# EAGLE design SAM_D21_DevBoard (EAGLE 8.1.0)
COMPANY: Tomasz Pasierbski; DRAWN: Pasierbski; REV: A
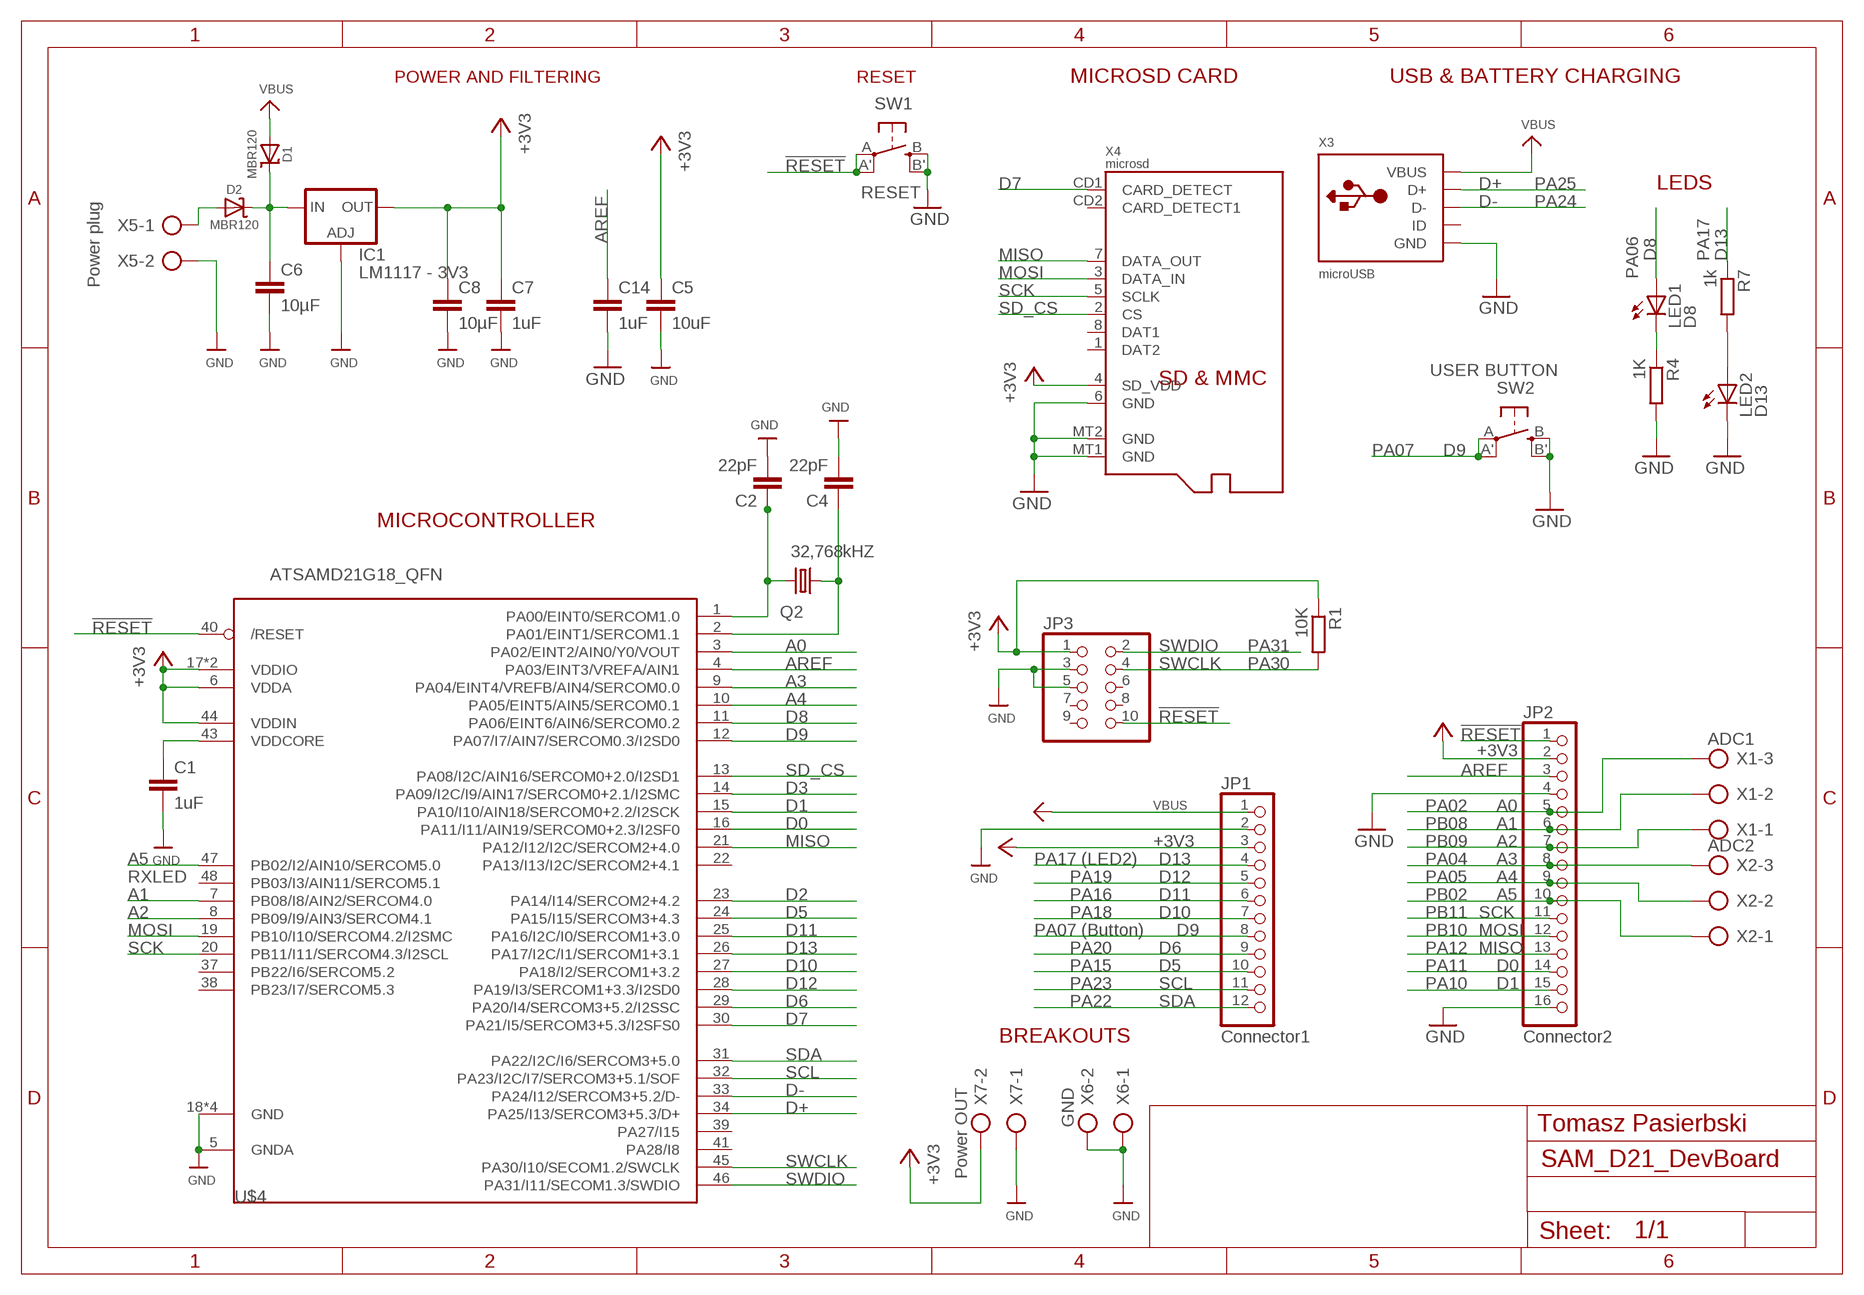
[diagram p0: schematic, sheet 1]

## Parts
C1  1uF  C-EUC1206  [C1206]
C2  22pF  C-EUC1206  [C1206]
C4  22pF  C-EUC1206  [C1206]
C5  10uF  C-EUC1206  [C1206]
C6  10µF  C-EUC1206  [C1206]
C7  1uF  C-EUC1206  [C1206]
C8  10µF  C-EUC1206  [C1206]
C14  1uF  C-EUC1206  [C1206]
D1  MBR120  DIODE-SCHOTTKYSOD-123  [SOD-123]
D2  MBR120  DIODE-SCHOTTKYSOD-123  [SOD-123]
IC1  LM1117 - 3V3  LD117AS33TR  [SOT223]
JP1  Connector1  PINHD-1X12  [1X12]
JP2  Connector2  PINHD-1X16  [1X16]
JP3  PINHD-2X5  [2X05]
LED1  D8  LEDSMT1206  [1206]
LED2  D13  LEDSMT1206  [1206]
Q2  32,768kHZ  CRYSTALHC49UP  [HC49UP]
R1  10K  R-EU_M1206  [M1206]
R4  1K  R-EU_M1206  [M1206]
R7  1k  R-EU_M1206  [M1206]
SW1  RESET  SPST_TACT-EVQQ2  [EVQ-Q2]
SW2  USER BUTTON  SPST_TACT-EVQQ2  [EVQ-Q2]
U$4  ATSAMD21G18_QFN  ATSAMD21J_QFN  [TQFN48_7MM]
X1  ADC1  AK300/3  [AK300/3]
X2  ADC2  AK300/3  [AK300/3]
X3  microUSB  USB_MICRO_20329_V2  [4UCONN_20329_V2]
X4  microsd  MICROSD  [MICROSD]
X5  Power plug  AK300/2  [AK300/2]
X6  GND  AK300/2  [AK300/2]
X7  Power OUT  AK300/2  [AK300/2]

## Nets
!RESET: JP2.1 JP3.10 SW1.A'(P1) SW1.A(P) U$4.40(/RESET)
+3V3: C5.1 C7.1 C8.1 IC1.4(OUT) JP1.3 JP2.2 JP3.1 R1.1 U$4.6(VDDA) U$4.17(VDDIO) U$4.36(VDDIO) U$4.44(VDDIN) X4.4(SD_VDD) X7.2
A0: JP2.5 U$4.3(PA02/EINT2/AIN0/Y0/VOUT) X1.3
A1: JP2.6 U$4.7(PB08/I8/AIN2/SERCOM4.0) X1.2
A2: JP2.7 U$4.8(PB09/I9/AIN3/SERCOM4.1) X1.1
A3: JP2.8 U$4.9(PA04/EINT4/VREFB/AIN4/SERCOM0.0) X2.3
A4: JP2.9 U$4.10(PA05/EINT5/AIN5/SERCOM0.1) X2.2
A5: JP2.10 U$4.47(PB02/I2/AIN10/SERCOM5.0) X2.1
AREF: C14.1 JP2.3 U$4.4(PA03/EINT3/VREFA/AIN1)
D0: JP2.14 U$4.16(PA11/I11/AIN19/SERCOM0+2.3/I2SF0)
D1: JP2.15 U$4.15(PA10/I10/AIN18/SERCOM0+2.2/I2SCK)
D2: U$4.23(PA14/I14/SERCOM2+4.2)
D3: U$4.14(PA09/I2C/I9/AIN17/SERCOM0+2.1/I2SMC)
D5: JP1.10 U$4.24(PA15/I15/SERCOM3+4.3)
D6: JP1.9 U$4.29(PA20/I4/SERCOM3+5.2/I2SSC)
D7: U$4.30(PA21/I5/SERCOM3+5.3/I2SFS0) X4.CD1(CARD_DETECT)
D8: LED1.A U$4.11(PA06/EINT6/AIN6/SERCOM0.2)
D9: JP1.8 SW2.A'(P1) SW2.A(P) U$4.12(PA07/I7/AIN7/SERCOM0.3/I2SD0)
D10: JP1.7 U$4.27(PA18/I2/SERCOM1+3.2)
D11: JP1.6 U$4.25(PA16/I2C/I0/SERCOM1+3.0)
D12: JP1.5 U$4.28(PA19/I3/SERCOM1+3.3/I2SD0)
D13: JP1.4 R7.1 U$4.26(PA17/I2C/I1/SERCOM1+3.1)
D+: U$4.34(PA25/I13/SERCOM3+5.3/D+) X3.D+
D-: U$4.33(PA24/I12/SERCOM3+5.2/D-) X3.D-
GND: C1.2 C2.2 C4.2 C5.2 C6.2 C7.2 C8.2 C14.2 IC1.1(ADJ) JP1.2 JP2.4 JP2.16 JP3.3 JP3.5 LED2.C R4.2 SW1.B'(S1) SW1.B(S) SW2.B'(S1) SW2.B(S) U$4.5(GNDA) U$4.18(GND) U$4.35(GND) U$4.42(GND) U$4.THERMAL(GND) X3.BASE@1(GND) X3.BASE@2(GND) X3.GND X3.SPRT@1(GND) X3.SPRT@2(GND) X3.SPRT@3(GND) X3.SPRT@4(GND) X4.6(GND) X4.MT1(GND) X4.MT2(GND) X5.2 X6.1 X6.2 X7.1
MISO: JP2.13 U$4.21(PA12/I12/I2C/SERCOM2+4.0) X4.7(DATA_OUT)
MOSI: JP2.12 U$4.19(PB10/I10/SERCOM4.2/I2SMC) X4.3(DATA_IN)
N$1: C6.1 D1.C D2.C IC1.3(IN)
N$2: LED2.A R7.2
N$4: D2.A X5.1
N$5: C2.1 Q2.2 U$4.1(PA00/EINT0/SERCOM1.0)
N$6: LED1.C R4.1
N$7: C4.1 Q2.1 U$4.2(PA01/EINT1/SERCOM1.1)
SCK: JP2.11 U$4.20(PB11/I11/SERCOM4.3/I2SCL) X4.5(SCLK)
SCL: JP1.11 U$4.32(PA23/I2C/I7/SERCOM3+5.1/SOF)
SD_CS: U$4.13(PA08/I2C/AIN16/SERCOM0+2.0/I2SD1) X4.2(CS)
SDA: JP1.12 U$4.31(PA22/I2C/I6/SERCOM3+5.0)
SWCLK: JP3.4 R1.2 U$4.45(PA30/I10/SECOM1.2/SWCLK)
SWDIO: JP3.2 U$4.46(PA31/I11/SECOM1.3/SWDIO)
VBUS: D1.A JP1.1 X3.VBUS
VDDCORE: C1.1 U$4.43(VDDCORE)
Unconnected: JP3.6 JP3.7 JP3.8 JP3.9 U$4.22(PA13/I13/I2C/SERCOM2+4.1) U$4.37(PB22/I6/SERCOM5.2) U$4.38(PB23/I7/SERCOM5.3) U$4.39(PA27/I15) U$4.41(PA28/I8) U$4.48(PB03/I3/AIN11/SERCOM5.1) X3.ID X4.1(DAT2) X4.8(DAT1) X4.CD2(CARD_DETECT1)

## Notes on the sheet
- POWER AND FILTERING | RESET | MICROSD CARD | USB & BATTERY CHARGING
- PA25
- LEDS
- PA24
- PA17
- PA06
- PA07
- MICROCONTROLLER
- PA31
- PA30
- PA02
- PB08
- PB09
- PA17 (LED2) | PA04
- RXLED | PA19 | PA05
- PA16 | PB02
- PA18 | PB11
- PA07 (Button) | PB10
- PA20 | PA12
- PA15 | PA11
- PA23 | PA10
- PA22
- BREAKOUTS
- Tomasz Pasierbski

## Library data of the parts
C1 C2 C4-C8 C14 = rcl:C-EU: CAPACITOR, European symbol
D1 D2 = microbuilder:DIODE-SCHOTTKY
IC1 = v-reg:LD117A?*: Low drop fixed and adjustable positive voltage regulators 1 A Source: http://www.st.com/stonline/products/literature/ds/7194/ld1117axx.pdf
JP1 = pinhead:PINHD-1X12: PIN HEADER
JP2 = pinhead:PINHD-1X16: PIN HEADER
JP3 = pinhead:PINHD-2X5: PIN HEADER
LED1 LED2 = led:LED: LED OSRAM: - CHIPLED LG R971, LG N971, LY N971, LG Q971, LY Q971, LO R971, LY R971 LH N974, LH R974 LS Q976, LO Q976, LY Q976 LO Q996 - Hyper CHIPLED LW Q18S LB Q993, LB Q99A, LB R99A - SideLED LS A670, LO A670, LY A670, LG A670, LP A670 LB A673, LV A673, LT A673, LW A673 LH A674 LY A675 LS A676, LA A676, LO A676, LY A676, LW A676 LS A679, LY A679, LG A679 - Hyper Micro SIDELED® LS Y876, LA Y876, LO Y876, LY Y876 LT Y87S - SmartLED LW L88C, LW L88S LB L89C, LB L89S, LG L890 LS L89K, LO L89K, LY L89K LS L896, LA L896, LO L896, LY L896 - TOPLED LS T670, LO T670, LY T670, LG T670, LP T670 LSG T670, LSP T670, LSY T670, LOP T670, LYG T670 LG T671, LOG T671, LSG T671 LB T673, LV T673, LT T673, LW T673 LH T674 LS T676, LA T676, LO T676, LY T676, LB T676, LH T676, LSB T676, LW T676 LB T67C, LV T67C, LT T67C, LS T67K, LO T67K, LY T67K, LW E67C LS E67B, LA E67B, LO E67B, LY E67B, LB E67C, LV E67C, LT E67C LW T67C LS T679, LY T679, LG T679 LS T770, LO T770, LY T770, LG T770, LP T770 LB T773, LV T773, LT T773, LW T773 LH T774 LS E675, LA E675, LY E675, LS T675 LS T776, LA T776, LO T776, LY T776, LB T776 LHGB T686 LT T68C, LB T68C - Hyper Mini TOPLED® LB M676 - Mini TOPLED Santana® LG M470 LS M47K, LO M47K, LY M47K Source: http://www.osram.convergy.de LUXEON: - LUMILED® LXK2-PW12-R00, LXK2-PW12-S00, LXK2-PW14-U00, LXK2-PW14-V00 LXK2-PM12-R00, LXK2-PM12-S00, LXK2-PM14-U00 LXK2-PE12-Q00, LXK2-PE12-R00, LXK2-PE12-S00, LXK2-PE14-T00, LXK2-PE14-U00 LXK2-PB12-K00, LXK2-PB12-L00, LXK2-PB12-M00, LXK2-PB14-N00, LXK2-PB14-P00, LXK2-PB14-Q00 LXK2-PR12-L00, LXK2-PR12-M00, LXK2-PR14-Q00, LXK2-PR14-R00 LXK2-PD12-Q00, LXK2-PD12-R00, LXK2-PD12-S00 LXK2-PH12-R00, LXK2-PH12-S00 LXK2-PL12-P00, LXK2-PL12-Q00, LXK2-PL12-R00 Source: www.luxeon.com KINGBRIGHT: KA-3528ASYC Source: www.kingbright.com
Q2 = crystal:CRYSTAL: CRYSTAL; OC_FARNELL: unknown; OC_NEWARK: unknown
R1 R4 R7 = rcl:R-EU_: RESISTOR, European symbol
SW1 SW2 = adafruit:SPST_TACT: SMT 6mm switch, EVQQ2 series http://www.ladyada.net/library/eagle
U$4 = microbuilder:ATSAMD21J
X1 X2 = con-ptr500:AK300/3: CONNECTOR; OC_FARNELL: unknown; OC_NEWARK: unknown
X3 = microbuilder:USB: USB Connectors USBMINIB - Surface Mount Female Mini-B USB Connector 4UConnector: 06564
X4 = microbuilder:MICROSD: MicroSD/Transflash Card Holder with SPI pinout 3M: 2908-05WB-MG 4UConnector: 19656 Footprint courtesy: Adafruit Industries
X5-X7 = con-ptr500:AK300/2: CONNECTOR; OC_FARNELL: unknown; OC_NEWARK: unknown

## Board
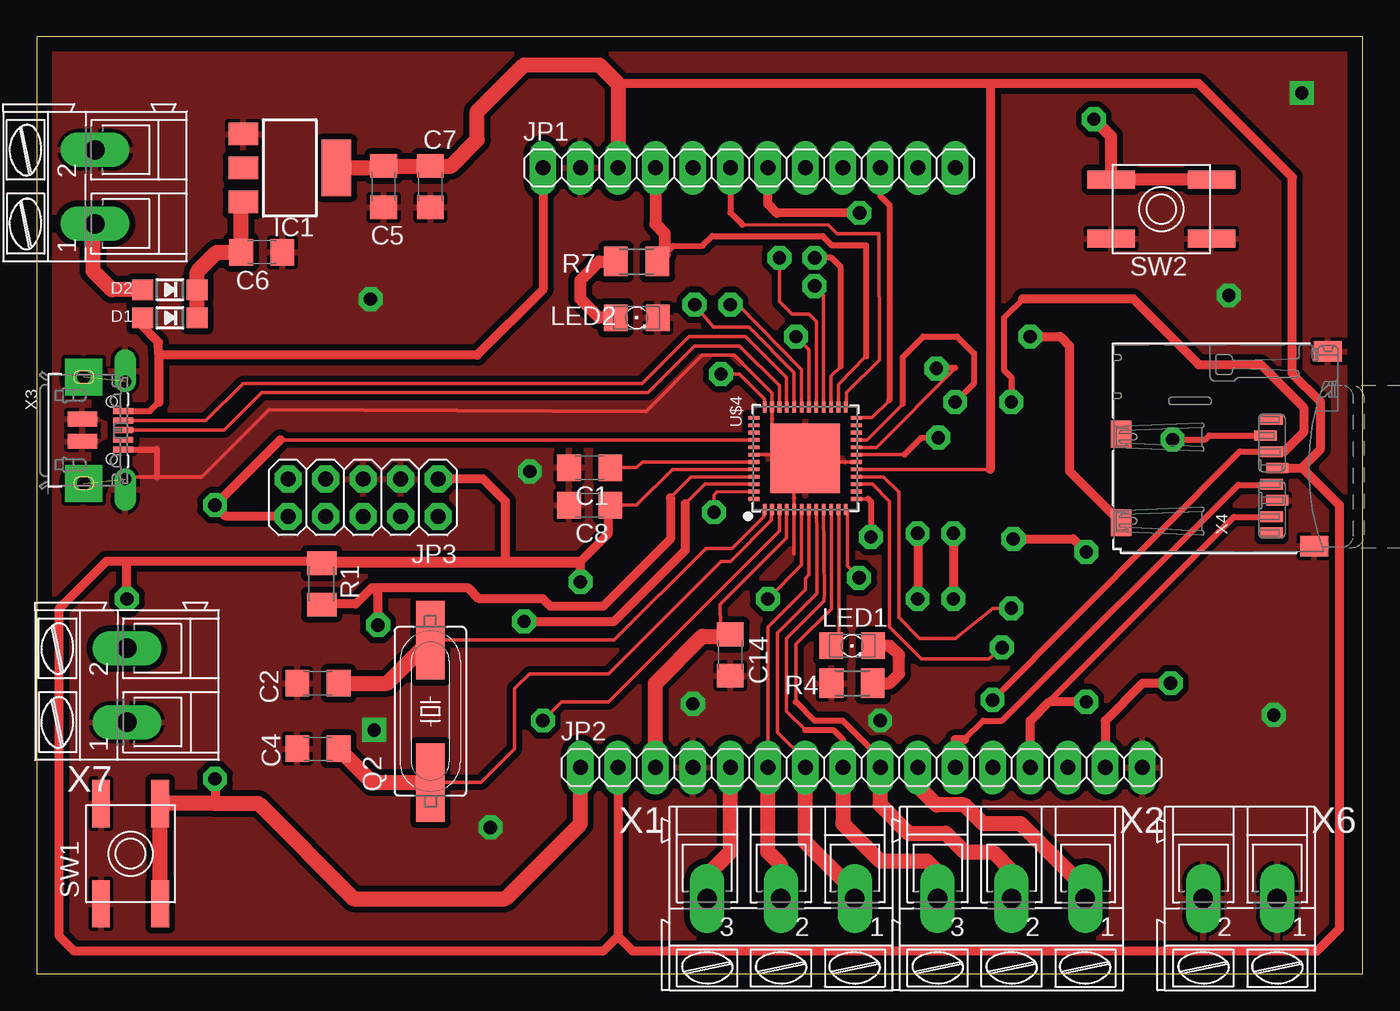
[diagram p1: board, top side]
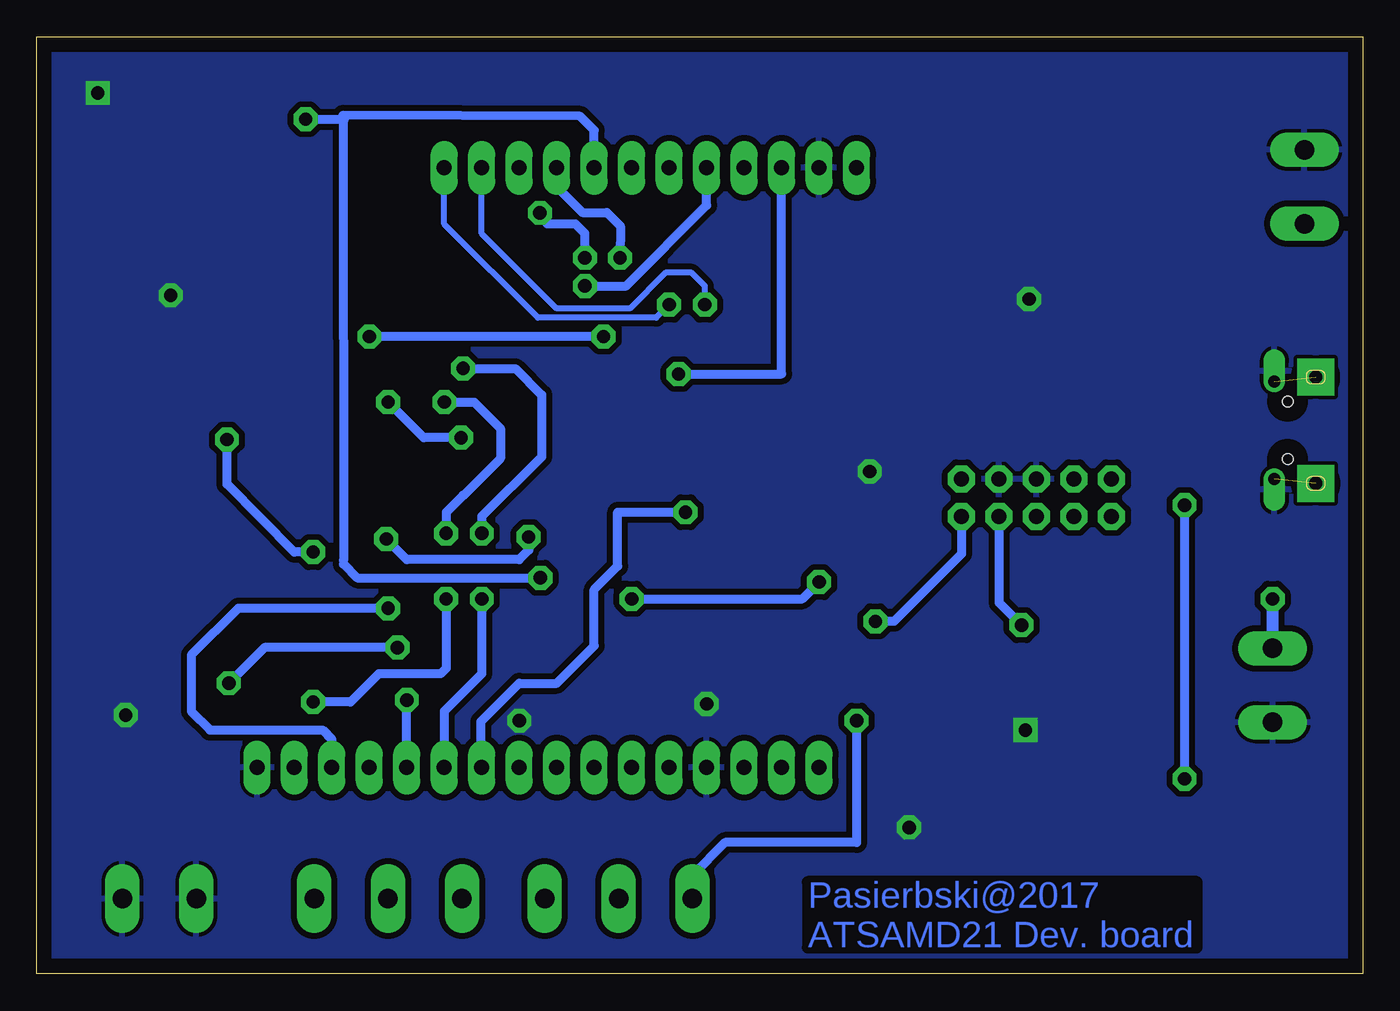
[diagram p2: board, bottom side, seen from below]

Size 89.84 x 63.49 mm. Coordinates in mm from the lower left corner, seen from the top.
Outline: 0,0 89.84,0 89.84,63.49 0,63.49 0,0
Copper layers (1*16): Top 0.035mm / dielectric 1.5mm / Bottom 0.035mm
Design rules "default *": minimum track width 8mil, minimum drill 24mil, track to track 8mil, track to pad 8mil, pad to pad 8mil, via to via 8mil, smd to smd 8mil, copper to edge 40mil, drill to drill 16mil, minimum pad ring 10mil, minimum via ring 8mil, stop-mask expansion 4mil, vias tented up to drill 0mil, thermal gap 10mil

### Footprints (pad centres in the part's own frame; a part is rotated, then mirrored left to right if it is on the bottom)
C1206 = smd 1.6 x 1.8: 1 -1.4,0; 2 1.4,0
SOD-123 = smd 1.4 x 1.4: A 1.85,0; C -1.85,0
SOT223 = smd 1.5 x 2: 1 -2.3,-3.15; 2 0,-3.15; 3 2.3,-3.15 | smd 3.8 x 2: 4 0,3.15
1X12 = drill 1.016 long: 1 -13.97,0; 2 -11.43,0; 3 -8.89,0; 4 -6.35,0; 5 -3.81,0; 6 -1.27,0; 7 1.27,0; 8 3.81,0; 9 6.35,0; 10 8.89,0; 11 11.43,0; 12 13.97,0
1X16 = drill 1.016 long: 1 -19.05,0; 2 -16.51,0; 3 -13.97,0; 4 -11.43,0; 5 -8.89,0; 6 -6.35,0; 7 -3.81,0; 8 -1.27,0; 9 1.27,0; 10 3.81,0; 11 6.35,0; 12 8.89,0; 13 11.43,0; 14 13.97,0; 15 16.51,0; 16 19.05,0
2X05 = drill 1.016 octagon: 1 -5.08,-1.27; 2 -5.08,1.27; 3 -2.54,-1.27; 4 -2.54,1.27; 5 0,-1.27; 6 0,1.27; 7 2.54,-1.27; 8 2.54,1.27; 9 5.08,-1.27; 10 5.08,1.27
1206 = smd 1.6 x 1.803: A -1.422,0; C 1.422,0
HC49UP = smd 5.334 x 1.93: 1 -4.826,0; 2 4.826,0
M1206 = smd 1.6 x 2: 1 -1.4,0; 2 1.4,0
EVQ-Q2 = smd 3.2 x 1.2: A -3.4,-2; A' 3.4,-2; B -3.4,2; B' 3.4,2
TQFN48_7MM = smd 0.25 x 0.75: 1 -2.75,-3.475; 2 -2.25,-3.475; 3 -1.75,-3.475; 4 -1.25,-3.475; 5 -0.75,-3.475; 6 -0.25,-3.475; 7 0.25,-3.475; 8 0.75,-3.475; 9 1.25,-3.475; 10 1.75,-3.475; 11 2.25,-3.475; 12 2.75,-3.475; 25 2.75,3.475; 26 2.25,3.475; 27 1.75,3.475; 28 1.25,3.475; 29 0.75,3.475; 30 0.25,3.475; 31 -0.25,3.475; 32 -0.75,3.475; 33 -1.25,3.475; 34 -1.75,3.475; 35 -2.25,3.475; 36 -2.75,3.475 | smd 0.75 x 0.25: 13 3.475,-2.75; 14 3.475,-2.25; 15 3.475,-1.75; 16 3.475,-1.25; 17 3.475,-0.75; 18 3.475,-0.25; 19 3.475,0.25; 20 3.475,0.75; 21 3.475,1.25; 22 3.475,1.75; 23 3.475,2.25; 24 3.475,2.75; 37 -3.475,2.75; 38 -3.475,2.25; 39 -3.475,1.75; 40 -3.475,1.25; 41 -3.475,0.75; 42 -3.475,0.25; 43 -3.475,-0.25; 44 -3.475,-0.75; 45 -3.475,-1.25; 46 -3.475,-1.75; 47 -3.475,-2.25; 48 -3.475,-2.75 | smd 4.7 x 4.7: THERMAL 0,0
AK300/3 = drill 1.321 long: 1 -5.004,0; 2 0,0; 3 5.004,0
4UCONN_20329_V2 = smd 1 x 2: BASE@1 -0.75,-2; BASE@2 0.75,-2 | smd 0.4 x 1.35: D+ 0,0.775; D- -0.65,0.775; GND 1.3,0.775; ID 0.65,0.775; VBUS -1.3,0.775 | drill 0.8 pad 1.2 offset: SPRT@1 -3.3,0.9; SPRT@2 3.3,0.9 | drill 0.9 pad 2.5 square: SPRT@3 -3.6,-1.9; SPRT@4 3.6,-1.9 | hole 0.7: -1.95,0; 1.95,0
MICROSD = smd 0.7 x 1.5: 1 9,-10.64; 2 7.9,-10.24; 3 6.8,-10.64; 4 5.7,-11.04; 5 4.6,-10.64; 6 3.5,-11.04; 7 2.4,-10.64; 8 1.3,-10.64 | smd 1.8 x 1.4: CD1 2,-0.44; CD2 8,-0.44 | smd 1.4 x 1.9: MT1 0.4,-13.54; MT2 13.6,-14.44
AK300/2 = drill 1.321 long: 1 -2.515,0; 2 2.489,0

### Placement (x,y rotation side)
C1  37.47,34.29 180 top
C2  19.05,19.68 180 top
C4  19.05,15.24 180 top
C5  23.5,53.34 270 top
C6  15.24,48.9 0 top
C7  26.67,53.34 270 top
C8  37.47,31.75 180 top
C14  46.99,21.59 270 top
D1  9.02,44.45 180 top
D2  9.02,46.35 180 top
IC1  17.14,54.61 270 top
JP1  48.26,54.61 0 top
JP2  55.88,13.97 0 top
JP3  22.1,32.26 180 top
LED1  55.24,22.23 0 top
LED2  40.64,44.45 0 top
Q2  26.67,17.78 90 top
R1  19.3,26.42 270 top
R4  55.24,19.68 180 top
R7  40.64,48.26 180 top
SW1  6.35,8.13 90 top
SW2  76.2,51.82 180 top
U$4  52.07,34.92 0 top
X1  50.42,5.08 180 top
X2  66.04,5.08 180 top
X3  5.08,36.83 270 top
X4  73.03,28.57 90 top
X5  3.94,53.34 90 top
X6  81.53,5.08 180 top
X7  6.1,19.56 90 top

### Tracks (layer width: path | path; a pad name or v marks a point on that pad's centre or on a via)
!RESET  (via drill 0.9)
  Top 0.254: U$4.40 16.49,36.17
  Top 0.61: 16.49,36.17 v12.06,31.75 12.83,30.99 JP3.10 | v12.06,13.21 12.06,11.53
  Top 1.016: SW1.A SW1.A' 12.06,11.53 15.02,11.53 21.46,5.08 31.75,5.08 36.83,10.16 JP2.1
  Bottom 0.61: v12.06,31.75 v12.06,13.21
+3V3  (via drill 0.9)
  Top 0.254: U$4.44 43.06,34.17 40.64,31.75 C8.1 | U$4.6 51.82,27.69 v49.53,25.4 | U$4.36 49.32,38.95 47.62,40.64 v46.35,40.64 | 64.61,34.18 56.17,34.18 U$4.17
  Top 0.406: 85.71,34.27 85.74,34.27 | 36.83,27.81 36.83,27.94 | R1.1 31.75,27.81
  Top 0.61: X4.4 85.71,34.27 87,35.56 87,38.73 85.09,40.64 85.09,53.98 78.74,60.33 64.61,60.33 | 64.61,60.33 39.37,60.33 | 85.74,34.27 88.27,31.75 88.27,3.05 86.74,1.52 40.39,1.52 39.37,2.54 | JP2.2 39.37,2.54 | 39.37,2.54 38.35,1.52 2.54,1.52 1.52,2.54 1.52,24.77 4.7,27.94 6.1,27.94 | 36.83,27.94 6.1,27.94 | 36.83,27.94 38.73,29.84 38.73,31.62 C8.1 | v36.83,26.54 36.83,27.94 | 64.61,60.33 64.61,34.18 | v6.1,25.4 6.1,27.94 | 36.83,27.81 R1.1 | 31.75,27.81 31.75,32 30.23,33.53 JP3.1
  Top 1.016: IC1.4 23.5,54.61 C5.1 C7.1 28.07,54.74 29.84,56.52 29.84,58.42 33.02,61.59 38.1,61.59 39.37,60.33 JP1.3
  Bottom 0.61: v49.53,25.4 37.97,25.4 v36.83,26.54 | v46.35,40.64 39.37,40.64 JP1.3
  Bottom 0.813: X7.2 v6.1,25.4
A0  (via drill 0.9)
  Top 0.254: U$4.3 50.32,31.43 50.32,30 38.73,18.41 35.56,18.41 v34.29,17.14
  Top 1.016: X1.3 45.41,6.68 46.99,8.26 JP2.5
  Bottom 0.61: v34.29,17.14 34.29,8.89 43.2,8.89 45.41,6.68 X1.3
A1
  Top 0.254: JP2.6 49.53,23.5 52.07,26.04 52.07,26.8 52.32,27.05 U$4.7
  Top 1.016: X1.2 50.42,7.37 49.53,8.26 JP2.6
A2
  Top 0.254: U$4.8 52.86,29.65 52.86,25.78 50.17,23.09 50.19,16.36 52.1,14.45 52.1,13.81 JP2.7
  Top 1.016: X1.1 55.42,5.54 52.07,8.89 JP2.7
A3
  Top 0.254: U$4.9 53.37,25.62 53.34,25.4 53.34,25.27 50.8,22.73 50.8,17.78 52.07,16.51
  Top 0.406: 52.07,16.51 53.98,16.51 54.61,15.88 JP2.8
  Top 1.016: X2.3 61.04,6.91 60.33,7.62 57.15,7.62 54.61,10.16 JP2.8
A4
  Top 0.254: 51.44,18.41 51.44,22.35 53.85,24.71 53.85,31.42 U$4.10
  Top 0.406: JP2.9 57.15,14.61 54.61,17.14 52.7,17.14 51.44,18.41
  Top 1.016: JP2.9 57.15,11.43 59.05,9.53 61.59,9.53 62.87,8.26 64.77,8.26 66.04,6.99 X2.2
A5  (via drill 0.9)
  Top 0.254: v45.88,31.27 45.88,32.42 46.06,32.64 46.07,32.65 46.09,32.65 U$4.47
  Top 1.016: JP2.10 59.69,12.7 60.96,11.43 62.87,11.43 64.14,10.16 66.67,10.16 71.04,5.79 X2.1
  Bottom 0.61: v45.88,31.27 50.48,31.27 50.48,27.62 52.07,26.04 52.07,22.23 54.61,19.68 57.15,19.68 59.75,17.08 59.75,15.18 59.69,15.24 JP2.10
AREF
  Top 0.254: U$4.4 50.8,31.43 50.8,29.53 46.3,25.03 46.32,23.53 46.32,23.02 C14.1
  Top 1.016: JP2.3 41.91,19.68 45.09,22.86 46.86,22.86 C14.1
D0  (via drill 0.9)
  Top 0.254: U$4.16 57.38,33.67 58.42,32.64 58.42,24.13 59.82,22.73 62.23,22.73 64.77,24.77 v66.04,24.77
  Bottom 0.61: v66.04,24.77 76.2,24.77 79.38,21.59 79.38,17.78 78.11,16.51 70.48,16.51 69.85,15.88 JP2.14
D1  (via drill 0.9)
  Top 0.254: U$4.15 56.61,33.17 57.78,32 57.78,23.5 59.94,21.34 64.52,21.34 v65.41,22.1
  Top 0.61: v76.83,19.68 74.93,19.68 72.39,17.14 JP2.15
  Bottom 0.61: v65.41,22.1 74.42,22.1 v76.83,19.68
D5
  Top 0.254: 57.77,38.85 56.6,37.68 U$4.24
  Top 0.406: JP1.10 57.15,52.7 57.78,52.07 57.77,38.85
D6  (via drill 0.9)
  Top 0.254: v50.32,48.51 50.32,45.56 51.18,44.7 52.32,44.7 52.83,44.2 52.81,39.69 U$4.29
  Bottom 0.61: v50.32,48.51 50.29,50.67 51.21,51.59 52.86,51.59 54.61,53.34 JP1.9
D7  (via drill 0.9)
  Top 0.254: U$4.30 52.32,42.3 v51.44,43.18
  Top 0.61: v67.31,43.18 69.34,43.18 69.98,42.55 69.98,34.06 X4.CD1
  Bottom 0.61: v51.44,43.18 v67.31,43.18
D8
  Top 0.254: U$4.11 54.34,31.43 54.34,22.54 53.98,22.23 LED1.A
D9  (via drill 0.9)
  Top 0.254: v55.72,26.83 54.93,27.62 54.93,31.43 U$4.12
  Top 0.813: SW2.A SW2.A' 72.8,56.74 v71.63,57.91
  Bottom 0.254: 69.06,28 69.06,27.76
  Bottom 0.61: 69.06,27.76 68.12,26.82 v55.72,26.83 | 69.06,28 69.09,57.91 69.09,58.17 53.02,58.1 52.07,57.15 JP1.8 | v71.63,57.91 69.09,57.91
  Bottom 0.813: 69.09,57.91
D10  (via drill 0.9)
  Top 0.254: U$4.27 53.82,40.48 54.48,41.15 | 54.48,47.7 54.48,47.88
  Top 0.406: 54.48,41.15 54.48,47.7 | 54.48,47.88 53.85,48.51 v52.7,48.51
  Top 0.61: v55.75,51.56 50.16,51.54 49.53,52.17 JP1.7
  Bottom 0.61: v52.7,48.51 52.7,50.16 53.34,50.8 55.24,50.8 v55.75,51.56
D11
  Top 0.254: 47.8,50.75 53.66,50.74 54.23,50.16 57.07,50.16 57.09,41.59 54.86,39.37 54.86,38.44 U$4.25
  Top 0.406: JP1.6 46.99,51.56 47.8,50.75
D12  (via drill 0.9)
  Top 0.254: U$4.28 53.32,45.99 v52.7,46.61
  Bottom 0.61: v52.7,46.61 49.91,46.61 44.45,52.07 JP1.5
D13
  Top 0.254: 56.2,41.85 54.3,39.93 U$4.26
  Top 0.406: 56.2,41.85 56.2,49.37 54.93,49.37 53.86,49.37 53.24,49.99 45.77,49.99 45.11,49.33 43.12,49.31 42.55,48.77
  Top 0.813: JP1.4 41.91,50.8 42.55,50.16 42.55,48.77 R7.1
D+
  Top 0.254: U$4.34 50.32,39.85 47.62,42.55 44.58,42.55 41.4,39.37 15.24,39.37 12.7,36.83 X3.D+
D-
  Top 0.254: X3.D- 11.45,37.48 13.97,40.01 41.02,40.01 44.2,43.18 48.01,43.18 50.8,40.39 50.8,38.42 U$4.33
GND  (via drill 0.9)  (2 unrouted)
  Top 0.254: U$4.42 51.82,35.17 U$4.THERMAL | U$4.18 52.32,34.67 U$4.THERMAL | U$4.THERMAL 51.32,34.17 U$4.5 51.32,30.59 51.31,28.45 | U$4.THERMAL 52.07,36.2 51.44,36.83 50.16,36.83 49.82,37.17 U$4.35 49.82,39.33 47.24,41.91 45.09,41.91 41.27,38.1 15.75,38.23 11.18,33.66 8.13,33.66 6.11,33.66 X3.SPRT@2 | X4.MT2 87.47,42.23 87.61,42.32
  Top 0.406: X3.GND 8.13,35.53 | 8.13,35.53 8.13,35.56 | 8.13,35.53 8.13,33.66
  other vias: 33.4,34.04 22.86,16.51 57.15,17.14 85.72,59.69 80.77,45.97 30.73,9.91 44.45,18.29 83.82,17.53 22.61,45.72
  pour Bottom (isolate 0.406): -2.54,66.04 93.98,66.04 93.98,-3.81 -2.54,-3.81
  pour Top (isolate 0.406): -2.54,66.04 92.71,66.04 92.71,-3.81 -2.54,-3.81
MISO  (via drill 0.9)
  Top 0.254: 83.66,30.96 X4.7 | U$4.21 56.24,36.17 58.67,38.61
  Top 0.406: 83.66,30.96 81.12,30.96 68.58,18.41 | 58.67,38.61 58.67,41.78 60.07,43.18 62.36,43.18 63.5,42.04 63.5,40.01 v62.23,38.73
  Top 0.61: JP2.13 67.31,17.14 68.58,18.41 v71.12,18.41 | v62.1,29.84 v62.1,25.4
  Bottom 0.254: 60.96,32.38 60.96,32.41
  Bottom 0.61: v62.23,38.73 60.2,38.73 58.42,36.96 58.42,34.92 60.96,32.38 | 60.96,32.41 62.1,31.27 v62.1,29.84 | v62.1,25.4 62.1,20.7 62.48,20.32 66.67,20.32 68.58,18.41 v71.12,18.41
MOSI  (via drill 0.9)
  Top 0.254: 83.71,35.4 X4.3 83.85,35.36 | U$4.19 58.8,35.17
  Top 0.406: 83.71,35.4 81.52,35.4 v64.77,18.54 | 58.8,35.17 59.94,36.32 v61.09,36.32 | 66.8,45.72 65.53,44.45 65.53,40.89 66.04,40.39 v66.04,38.73
  Top 0.61: 83.85,35.36 84.51,35.36 85.85,36.7 85.85,38.35 82.93,41.27 78.74,41.27 74.3,45.72 66.8,45.72
  Bottom 0.61: JP2.12 v64.77,18.54 | v61.09,36.32 63.63,36.32 v66.04,38.73
N$1
  Top 1.016: D1.C D2.C 10.87,47.57 12.19,48.9 C6.1 13.84,52.16 IC1.3
N$2
  Top 0.813: LED2.A 38.1,44.45 36.83,45.72 36.83,46.99 38.1,48.26 R7.2
N$4
  Top 1.016: D2.A 5.08,46.35 3.81,47.62 3.81,50.19 X5.1
N$5
  Top 0.254: Q2.2 39.12,22.61 45.34,28.83 47.12,28.83 49.28,30.99 49.28,31.41 U$4.1
  Top 1.016: C2.1 23.75,19.68 Q2.2
N$6
  Top 0.813: R4.1 57.78,19.68 58.42,20.32 58.42,21.59 57.78,22.23 LED1.C
N$7
  Top 0.254: Q2.1 30.1,12.95 32.38,15.24 32.38,19.33 32.41,19.36 33.4,20.32 38.73,20.32 46.35,27.94 46.99,27.94 49.78,30.73 49.78,31.41 U$4.2
  Top 1.016: C4.1 22.73,12.95 Q2.1
SCK  (via drill 0.9)
  Top 0.254: 83.81,33.12 X4.5 | U$4.20 56.88,35.67 62.23,41.05 | 60.94,41.05 v60.96,41.02
  Top 0.406: 83.81,33.12 81.43,33.12 65.41,17.14 64.14,17.14 62.87,15.88 | 62.23,41.05 60.94,41.05
  Top 0.61: JP2.11 62.23,15.88 62.87,15.88 | v59.69,29.84 v59.69,25.4
  Bottom 0.254: 55.63,35.03 55.75,34.9
  Bottom 0.61: v60.96,41.02 57.4,41 55.63,39.22 55.63,35.03 | 55.75,34.9 59.69,30.99 v59.69,29.84 | v59.69,25.4 59.69,20.32 62.23,17.78 JP2.11
SCL  (via drill 0.9)
  Top 0.254: U$4.32 51.32,40.76 48.26,43.81 45.85,43.81 v44.58,45.34
  Bottom 0.406: v44.58,45.34 44.58,46.61 45.47,47.5 47.24,47.5 49.66,45.09 54.61,45.09 59.69,50.16 JP1.11
SD_CS  (via drill 0.9)
  Top 0.254: U$4.13 56.34,32.17
  Top 0.406: 56.34,32.17 56.52,32 v56.52,29.59 | v76.96,36.2 79.17,36.2 79.45,36.47 X4.2
  Top 0.61: v66.17,29.46 70.23,29.46 v71.12,28.57
  Bottom 0.61: v56.52,29.59 56.52,28.7 57.15,28.07 64.77,28.07 v66.17,29.46 | v71.12,28.57 72.39,28.57 76.96,33.17 v76.96,36.2
SDA  (via drill 0.9)
  Top 0.254: U$4.31 51.82,40.94 47.5,45.34 v46.99,45.34
  Bottom 0.406: v46.99,45.34 47.88,44.45 55.88,44.45 62.23,50.8 JP1.12
SWCLK  (via drill 0.9)
  Top 0.254: U$4.45 44.34,33.67 42.93,32.26 | 19.33,25.04 R1.2
  Top 0.61: 42.93,32.26 42.93,29.46 38.35,24.89 34.8,24.89 34.29,25.4 29.97,25.4 29.21,26.16 22.71,26.16 | 22.71,26.16 21.59,25.04 19.33,25.04 | v23.11,23.62 23.11,25.76 22.71,26.16
  Bottom 0.61: JP3.4 24.64,25.15 v23.11,23.62
SWDIO  (via drill 0.9)
  Top 0.254: 43.94,31.85 45.26,33.17 U$4.46
  Top 0.61: v33.02,23.88 39.12,23.88 43.94,28.7 43.94,31.85
  Bottom 0.61: JP3.2 27.18,28.45 31.75,23.88 v33.02,23.88
VBUS
  Top 0.406: X3.VBUS 7.65,38.13 8.26,38.73 | 7.11,44.45 7.11,44.4 D1.A
  Top 0.61: 8.26,41.91 8.26,38.73 | 8.26,41.91 8.23,42.8 6.99,44.07 7.11,44.45 | JP1.1 34.29,46.35 29.84,41.91 8.26,41.91
VDDCORE
  Top 0.254: U$4.43 41.02,34.67 40.64,34.29 C1.1

### Text on the board
Bottom: Pasierbski@2017 / ATSAMD21 Dev. board